# EAGLE design ncn8025-breakout (EAGLE 7.7.0)
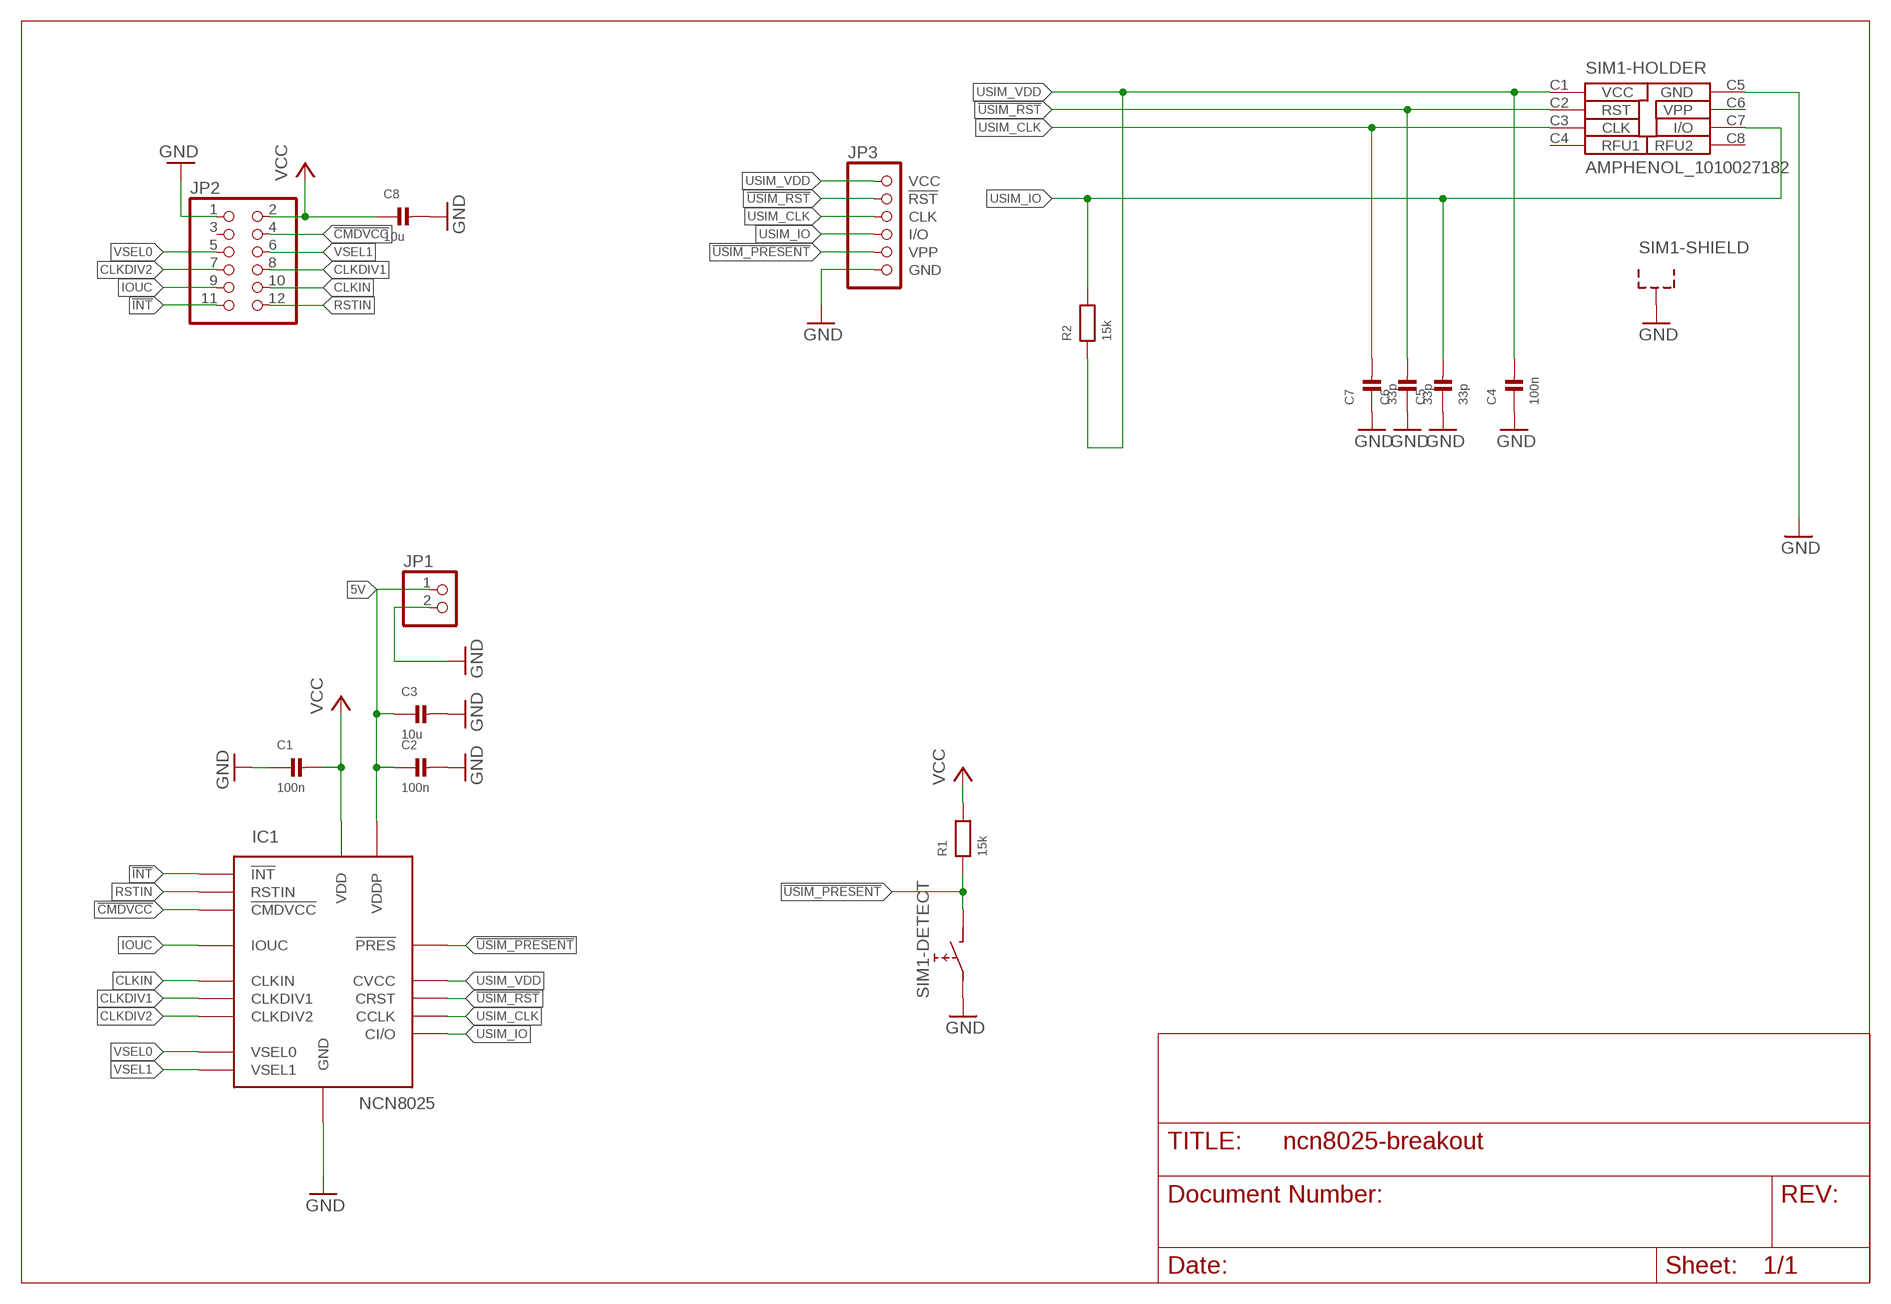
[diagram p0: schematic, sheet 1]

## Parts
C1  100n  CAP_CERAMIC_0603  [_0603]
C2  100n  CAP_CERAMIC_0603  [_0603]
C3  10u  CAP_CERAMIC_0603  [_0603]
C4  100n  CAP_CERAMIC_0603  [_0603]
C5  33p  CAP_CERAMIC_0603  [_0603]
C6  33p  CAP_CERAMIC_0603  [_0603]
C7  33p  CAP_CERAMIC_0603  [_0603]
C8  10u  CAP_CERAMIC_0603  [_0603]
IC1  NCN8025  [QFN16_3X3]
JP1  PINHD-1X2  [1X02]
JP2  PINHD-2X6  [2X06]
JP3  PINHD-1X6  [1X06]
R1  15k  RESISTOR_0603  [_0603]
R2  15k  RESISTOR_0603  [_0603]
SIM1  AMPHENOL_1010027182  [SIM-AMPHENOL]

## Nets
5V: C2.1 C3.1 IC1.2(VDDP) JP1.1
!CMDVCC: IC1.8(!CMDVCC) JP2.4
!INT: IC1.11(!INT) JP2.11
!USIM_PRESENT: IC1.3(!PRES) JP3.5(VPP) R1.1 SIM1.SW2
!USIM_RST: C6.2 IC1.6(CRST) JP3.2(!RST) SIM1.C2(-HOLDER:RST)
CLKDIV1: IC1.14(CLKDIV1) JP2.8
CLKDIV2: IC1.15(CLKDIV2) JP2.7
CLKIN: IC1.12(CLKIN) JP2.10
GND: C1.1 C2.2 C3.2 C4.1 C5.1 C6.1 C7.1 C8.2 IC1.EXPPAD(GND) JP1.2 JP2.1 JP3.6(GND) SIM1.@2(-SHIELD:SHLD) SIM1.@3(-SHIELD:SHLD) SIM1.C5(-HOLDER:GND) SIM1.SW1
IOUC: IC1.13(IOUC) JP2.9
RSTIN: IC1.9(RSTIN) JP2.12
USIM_CLK: C7.2 IC1.5(CCLK) JP3.3(CLK) SIM1.C3(-HOLDER:CLK)
USIM_IO: C5.2 IC1.4(CI/O) JP3.4(I/O) R2.2 SIM1.C7(-HOLDER:I/O)
USIM_VDD: C4.2 IC1.7(CVCC) JP3.1(VCC) R2.1 SIM1.C1(-HOLDER:VCC)
VCC: C1.2 C8.1 IC1.10(VDD) JP2.2 R1.2
VSEL0: IC1.1(VSEL0) JP2.5
VSEL1: IC1.16(VSEL1) JP2.6
Unconnected: JP2.3 SIM1.C4(-HOLDER:RFU1) SIM1.C8(-HOLDER:RFU2)

## Power pins joined to a net without a drawn wire
VPP: SIM1.C6(-HOLDER:VPP)

## Library data of the parts
C1-C8 = rc-sysmocom:CAP_CERAMIC: Ceramic Capacitors 0402 - 0402 Surface Mount Capacitors 16pF 50V 5% [Digikey: 445-4899-2-ND] 18pF 50V 5% [Digikey: 490-1281-2-ND] 22pF 50V 5% [Digikey: 490-1283-2-ND] 68pF 50V 5% [Digikey: 490-1289-2-ND] 0.1uF 10V 10% [Digikey: 490-1318-2-ND] 1.0uF 6.3V 10% [Digikey: 490-1320-2-ND] 0603 - 0603 Surface Mount Capacitors 16 pF 50V 5% [Digikey: 445-5051-2-ND] 22 pF 50V [Digikey: PCC220ACVTR-ND] 33 pF 50V 5% [Digikey: 490-1415-1-ND] 56pF 50V 5% [Digikey: 490-1421-1-ND] 220pF 50V 5% [Digikey: 445-1285-1-ND] 680 pF 50V 2200 pF 50V 5% C0G [Digikey: 445-1297-1-ND] 5600 pF 100V 5% X7R [Digikey: 478-3711-1-ND] 0.1 µF 25V 10% [Digikey: PCC2277TR-ND] 0.22 µF 16V 10% X7R [Digikey: 445-1318-1-ND] 1.0 µF 25V 10% [Digikey: 445-5146-2-ND] 0603 - RF Specific 3pF 250V +/-0.1pF RF [Digikey: 712-1347-1-ND] 18 pF 250V 5% [Digikey: 478-3505-1-ND or 712-1322-1-ND] 56 pF 250V 5% C0G RF [Digikey: 490-4867-1-ND] 68 pF 250V RF [Digikey: 490-4868-1-ND] 0805 - 0805 Surface Mount Capacitors 220 pF 250V 2% RF Ceramic Capacitor [Digikey: 712-1398-1-ND] 1000 pF 50V 2% NP0 Ceramic Capacitor [Digikey: 478-3760-1-ND] 0.1 µF 25V 10% Ceramic Capacitor [Digikey: PCC1828TR-ND] 1.0 µF 16V 10% Ceramic Capacitor[Digikey: 490-1691-2-ND] 10.0 µF 10V 10% Ceramic Capacitor[Digikey: 709-1228-1-ND] 10.0 uF 16V 10% Ceramic Capacitor [Digikey: 478-5165-2-ND] 47 uF 6.3V 20% Ceramic Capacitor [Digikey: 587-1779-1-ND or 399-5506-1-ND] 1206 - 1206 Surface Mount Capacitors 47uF 10V 20% Ceramic Capacitor [Digikey: 490-5528-1-ND or 399-5508-1-ND or 445-6010-1-ND] 100uF 6.3V -20%, +80% Y5V Ceramic Capacitor (Digikey: 490-4512-1-ND, Mouser: 81-GRM31CF50J107ZE1L) 1810 - 1810 Surface Mount Capacitors High volt MLC; no solder stop between for higher isolation
IC1 = NCN8025:NCN8025: NCN8025 / NCN8025A Compact SMART CARD Interface IC
JP1 = laforge:PINHD-1X2: PIN HEADER
JP2 = pinhead:PINHD-2X6: PIN HEADER
JP3 = laforge:PINHD-1X6: PIN HEADER
R1 R2 = rc-sysmocom:RESISTOR: Resistors 0402 - 0402 Surface Mount Package 22 Ohm 1% 1/16W [Digikey: 311-22.0LRTR-ND] 33 Ohm 5% 1/16W 1.0K 5% 1/16W 1.5K 5% 1/16W 2.0K 1% 1/16W 10.0K 1% 1/16W [Digikey: 311-10.0KLRTR-ND] 10.0K 5% 1/16W [Digikey: RMCF0402JT10K0TR-ND] 12.1K 1% 1/16W [Digikey: 311-22.0LRTR-ND] 100.0K 5% 1/16W 0603 - 0603 Surface Mount Package 1/10 Watt 0805 - 0805 Surface Mount Package 1/8 Watt 1206 - 1206 Surface Mount Package 2012 - 2010 Surface Mount Package 0.11 Ohm 1/2 Watt 1% Resistor - Digikey: RHM.11UCT-ND
SIM1 = SIM-Amphenol:AMPHENOL_1010027182: Amphenol SIM card holder with push lock and card detect switch

## Board
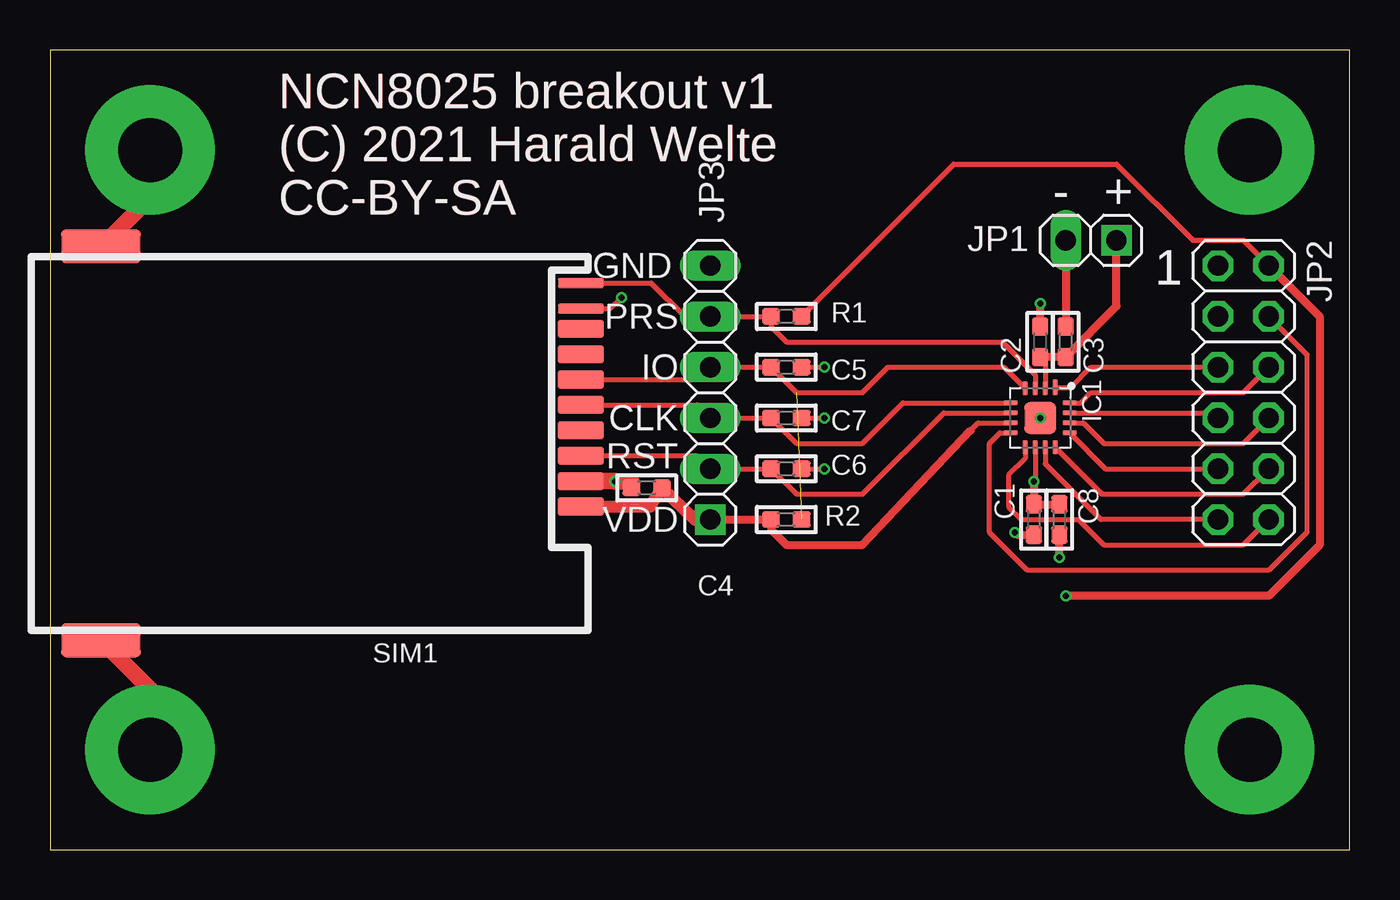
[diagram p1: board, top side]
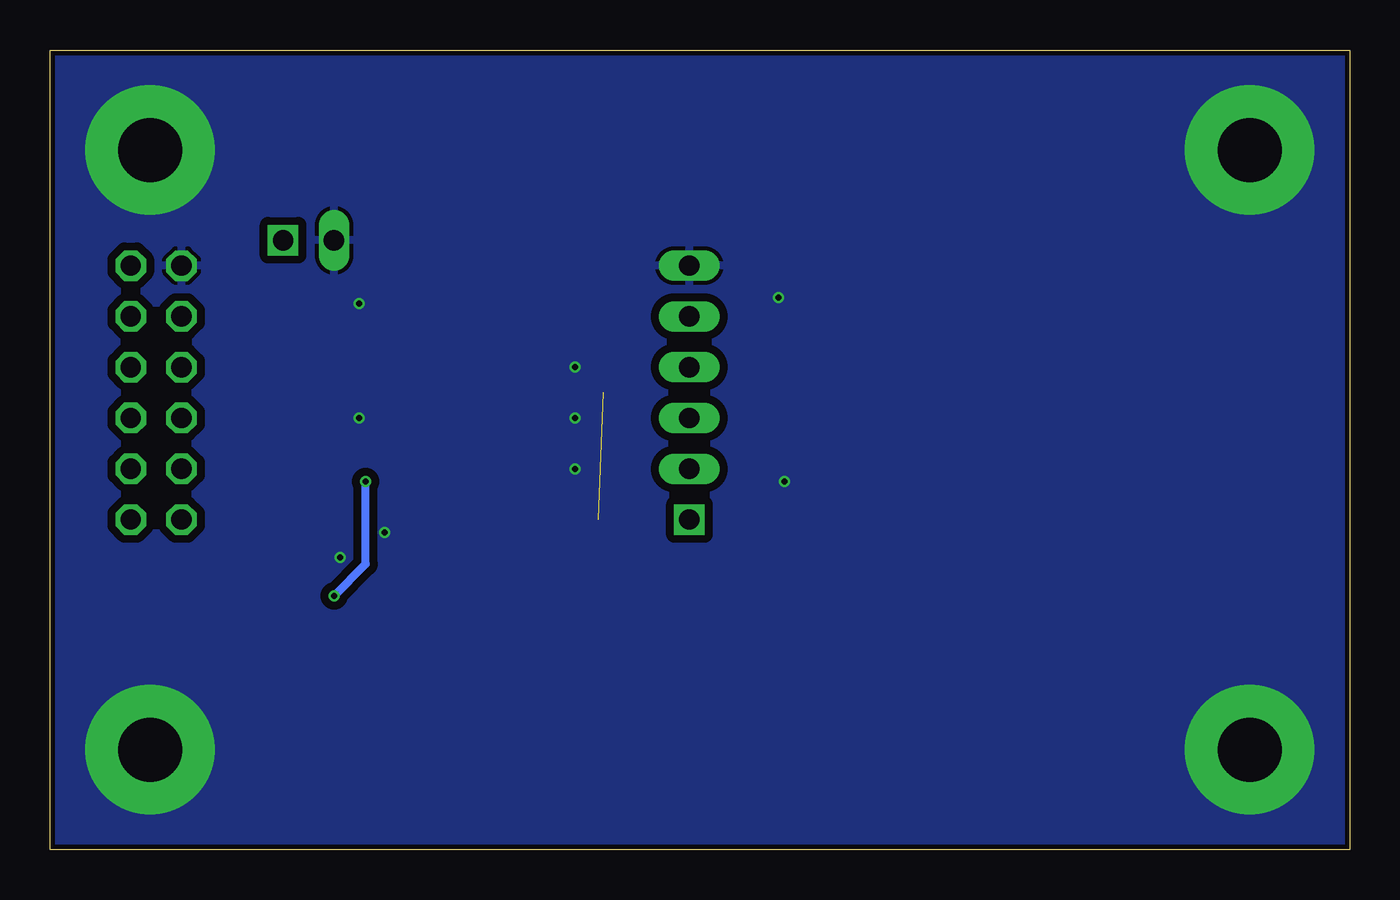
[diagram p2: board, bottom side, seen from below]

Size 65 x 40 mm. Coordinates in mm from the lower left corner, seen from the top.
Outline: 0,0 65,0 65,40 0,40 0,0
Copper layers (1*16): Top 0.018mm / dielectric 1.55mm / Bottom 0.018mm
Design rules "eC_2Layer_PClass6_BaseCopperO18_eCDefault *": minimum track width 0.15mm, minimum drill 0.35mm, track to track 0.4mm, track to pad 0.3mm, pad to pad 0.15mm, via to via 0.15mm, smd to smd 0mil, copper to edge 0.25mm, drill to drill 0.35mm, minimum pad ring 0.175mm, minimum via ring 0.125mm, stop-mask expansion 0mil, vias tented up to drill 0.45mm, thermal gap 0.2mm

### Footprints (pad centres in the part's own frame; a part is rotated, then mirrored left to right if it is on the bottom)
_0603 = smd 0.9 x 0.8: 1 -0.762,0; 2 0.762,0
QFN16_3X3 = smd 0.8 x 0.25: 1 -1.525,0.75 | smd 0.7 x 0.25: 2 -1.475,0.25; 3 -1.475,-0.25; 4 -1.475,-0.75; 9 1.475,-0.75; 10 1.475,-0.25; 11 1.475,0.25; 12 1.475,0.75 | smd 0.25 x 0.7: 5 -0.75,-1.475; 6 -0.25,-1.475; 7 0.25,-1.475; 8 0.75,-1.475; 13 0.75,1.475; 14 0.25,1.475; 15 -0.25,1.475; 16 -0.75,1.475 | smd 1.6 x 1.6: EXPPAD 0,0
1X02 = drill 1.016 square: 1 -1.27,0 | drill 1.016 long: 2 1.27,0
2X06 = drill 1.016 octagon: 1 -6.35,-1.27; 2 -6.35,1.27; 3 -3.81,-1.27; 4 -3.81,1.27; 5 -1.27,-1.27; 6 -1.27,1.27; 7 1.27,-1.27; 8 1.27,1.27; 9 3.81,-1.27; 10 3.81,1.27; 11 6.35,-1.27; 12 6.35,1.27
1X06 = drill 1.016 square: 1 -6.35,0 | drill 1.016 long: 2 -3.81,0; 3 -1.27,0; 4 1.27,0; 5 3.81,0; 6 6.35,0
SIM-AMPHENOL = smd 4 x 1.699: @2 10.15,-9.85; @3 10.15,9.85 | smd 2.3 x 0.9: C1 -13.851,3.16; C2 -13.851,0.62; C3 -13.851,-1.92; C4 -13.851,-4.46; C5 -13.851,1.89; C6 -13.851,-0.65; C7 -13.851,-3.19; C8 -13.851,-5.73 | smd 2.3 x 0.5: SW1 -13.851,-6.731; SW2 -13.851,-8.029

### Placement (x,y rotation side)
C1  49.21,16.51 90 top
C2  49.53,25.4 90 top
C3  50.8,25.4 90 top
C4  29.84,18.1 0 top
C5  36.83,24.13 180 top
C6  36.83,19.05 180 top
C7  36.83,21.59 180 top
C8  50.48,16.51 270 top
IC1  49.53,21.59 270 top
JP1  52.07,30.48 180 top
JP2  59.69,22.86 270 top
JP3  33.02,22.86 90 top
R1  36.83,26.67 0 top
R2  36.83,16.51 0 top
SIM1  12.7,20.32 180 top

### Tracks (layer width: path | path; a pad name or v marks a point on that pad's centre or on a via)
5V
  Top 0.254: C2.1 49.78,24.39 IC1.2
  Top 0.406: C2.1 C3.1 53.34,27.18 JP1.1
!CMDVCC
  Top 0.254: JP2.4 62.87,24.77 62.87,15.88 60.96,13.97 48.9,13.97 46.99,15.88 46.99,20.32 47.51,20.84 IC1.8
!INT
  Top 0.254: IC1.11 49.78,19.3 52.57,16.51 JP2.11
!USIM_PRESENT
  Top 0.254: SIM1.SW2 30.07,28.35 31.75,26.67 JP3.5 R1.1 36.07,26.16 36.83,25.4 47.62,25.4 49.28,23.75 IC1.3
!USIM_RST
  Top 0.254: SIM1.C2 32.37,19.7 JP3.2 C6.2 37.34,17.78 40.64,17.78 44.7,21.84 IC1.6
CLKDIV1
  Top 0.254: IC1.14 51.69,21.34 52.7,20.32 59.69,20.32 JP2.8
CLKDIV2
  Top 0.254: IC1.15 58.17,21.84 JP2.7
CLKIN
  Top 0.254: IC1.12 52.62,17.78 59.69,17.78 JP2.10
GND  (via drill 0.3, 3.2 pad 6.45)
  Top 0.254: C7.1 v38.73,21.59 | C5.1 v38.73,24.13 | C6.1 v38.73,19.05 | SIM1.SW1 28,27.05 v28.57,27.62 | 28.24,18.43 v28.26,18.41 | 29.08,18.41 C4.1
  Top 0.406: C2.2 v49.53,27.3 | JP1.2 C3.2 | v50.48,14.61 C8.2 | v48.26,15.88 48.39,15.75 C1.1
  Top 0.813: SIM1.C5 28.24,18.43 | v28.26,18.41 29.08,18.41 | SIM1.@3 5,8.02 v5,5 | SIM1.@2 5,32.62 v5,35
  other vias: 60,5 60,35 49.53,21.59
  pour Bottom: 0,0 0,40 65,40 65,0
IOUC
  Top 0.254: IC1.13 52.8,19.05 JP2.9
RSTIN
  Top 0.254: IC1.9 48.78,19.57 47.94,18.73 47.94,17.14 48.58,16.51 51.44,16.51 52.7,15.24 59.69,15.24 JP2.12
USIM_CLK
  Top 0.254: SIM1.C3 32.37,22.24 JP3.3 C7.2 37.34,20.32 40.64,20.32 42.66,22.34 IC1.5
USIM_IO  (1 unrouted)
  Top 0.254: SIM1.C7 32.4,23.51 JP3.4 C5.2 37.34,22.86 40.64,22.86 41.91,24.13 47.72,24.13 IC1.4
USIM_VDD
  Top 0.254: 46.04,20.95 46.42,21.34 IC1.7
  Top 0.406: JP3.1 R2.1 36.07,16 36.83,15.24 40.64,15.24 46.04,20.95
  Top 0.61: SIM1.C1 30.02,17.16 C4.2 32.26,16.51 JP3.1
VCC  (via drill 0.3)
  Top 0.254: IC1.10 49.28,18.66 v49.21,18.41 | R1.2 45.21,34.29 53.34,34.29 57.15,30.48 59.69,30.48 JP2.2
  Top 0.406: JP2.2 63.5,26.67 63.5,15.24 60.96,12.7 v50.8,12.7 | v49.21,18.41 C1.2 C8.1
  Bottom 0.406: v50.8,12.7 49.21,14.29 v49.21,18.41
VSEL0
  Top 0.254: IC1.1 51.05,23.11 52.07,24.13 JP2.5
VSEL1
  Top 0.254: IC1.16 51.55,22.34 52.07,22.86 59.69,22.86 JP2.6

### Text on the board
Top: NCN8025 breakout v1 / (C) 2021 Harald Welte / CC-BY-SA
tNames: NCN8025 breakout v1 / (C) 2021 Harald Welte / CC-BY-SA | - | + | GND | 1 | PRS | IO | CLK | RST | VDD